# Altium project ECE_491_Quadcopter_Sigmux.PrjPcb
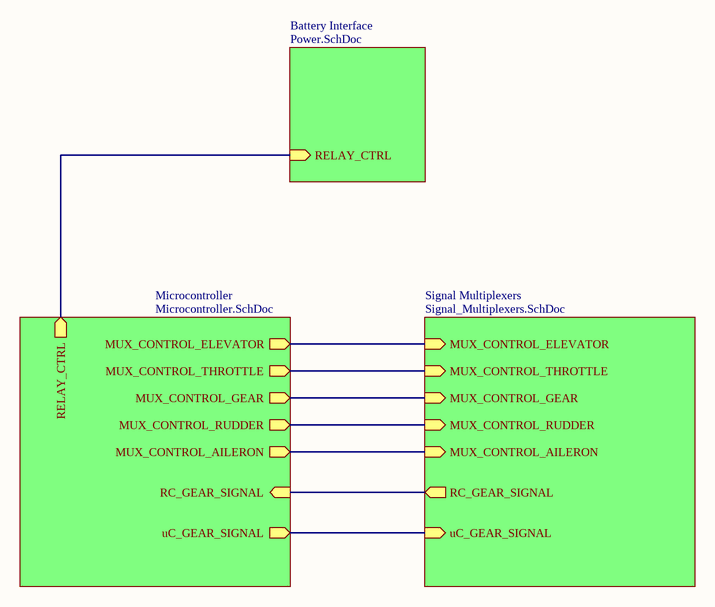
[diagram p0: Sigmux.SchDoc]
6 sheets, 56 parts. Net scope: hierarchical (ports join the sheet entries above them; power ports are global).
Board file: Sigmux.PcbDoc
Sheets:
  Sigmux.SchDoc
    Microcontroller = Microcontroller.SchDoc
    Battery Interface = Power.SchDoc
      Power Supplies = Power_Supplies.SchDoc
      Emergency Stop System = Relays.SchDoc
    Signal Multiplexers = Signal_Multiplexers.SchDoc

## Sheet Sigmux.SchDoc
size A4

### Sub-sheets
Battery Interface = Power.SchDoc: RELAY_CTRL (in)
Microcontroller = Microcontroller.SchDoc: MUX_CONTROL_ELEVATOR (out), MUX_CONTROL_THROTTLE (out), MUX_CONTROL_GEAR (out), RC_GEAR_SIGNAL (in), uC_GEAR_SIGNAL (out), RELAY_CTRL (out), MUX_CONTROL_RUDDER (out), MUX_CONTROL_AILERON (out)
Signal Multiplexers = Signal_Multiplexers.SchDoc: MUX_CONTROL_ELEVATOR (in), MUX_CONTROL_THROTTLE (in), MUX_CONTROL_GEAR (in), RC_GEAR_SIGNAL (out), uC_GEAR_SIGNAL (in), MUX_CONTROL_RUDDER (in), MUX_CONTROL_AILERON (in)

### Nets
MUX_CONTROL_AILERON: sheet Microcontroller/MUX_CONTROL_AILERON, sheet Signal Multiplexers/MUX_CONTROL_AILERON
MUX_CONTROL_ELEVATOR: sheet Microcontroller/MUX_CONTROL_ELEVATOR, sheet Signal Multiplexers/MUX_CONTROL_ELEVATOR
MUX_CONTROL_GEAR: sheet Microcontroller/MUX_CONTROL_GEAR, sheet Signal Multiplexers/MUX_CONTROL_GEAR
MUX_CONTROL_RUDDER: sheet Microcontroller/MUX_CONTROL_RUDDER, sheet Signal Multiplexers/MUX_CONTROL_RUDDER
MUX_CONTROL_THROTTLE: sheet Microcontroller/MUX_CONTROL_THROTTLE, sheet Signal Multiplexers/MUX_CONTROL_THROTTLE
RC_Gear_Signal: sheet Microcontroller/RC_GEAR_SIGNAL, sheet Signal Multiplexers/RC_GEAR_SIGNAL
RELAY_CTRL: sheet Microcontroller/RELAY_CTRL, sheet Battery Interface/RELAY_CTRL
uC_Gear_Signal: sheet Microcontroller/uC_GEAR_SIGNAL, sheet Signal Multiplexers/uC_GEAR_SIGNAL

### Notes on the sheet
- Title
- Size:
- Date:
- A4
- Number:
- Time:
- Revision:
- Sheet
- of
- File:

## Sheet Microcontroller.SchDoc
size B
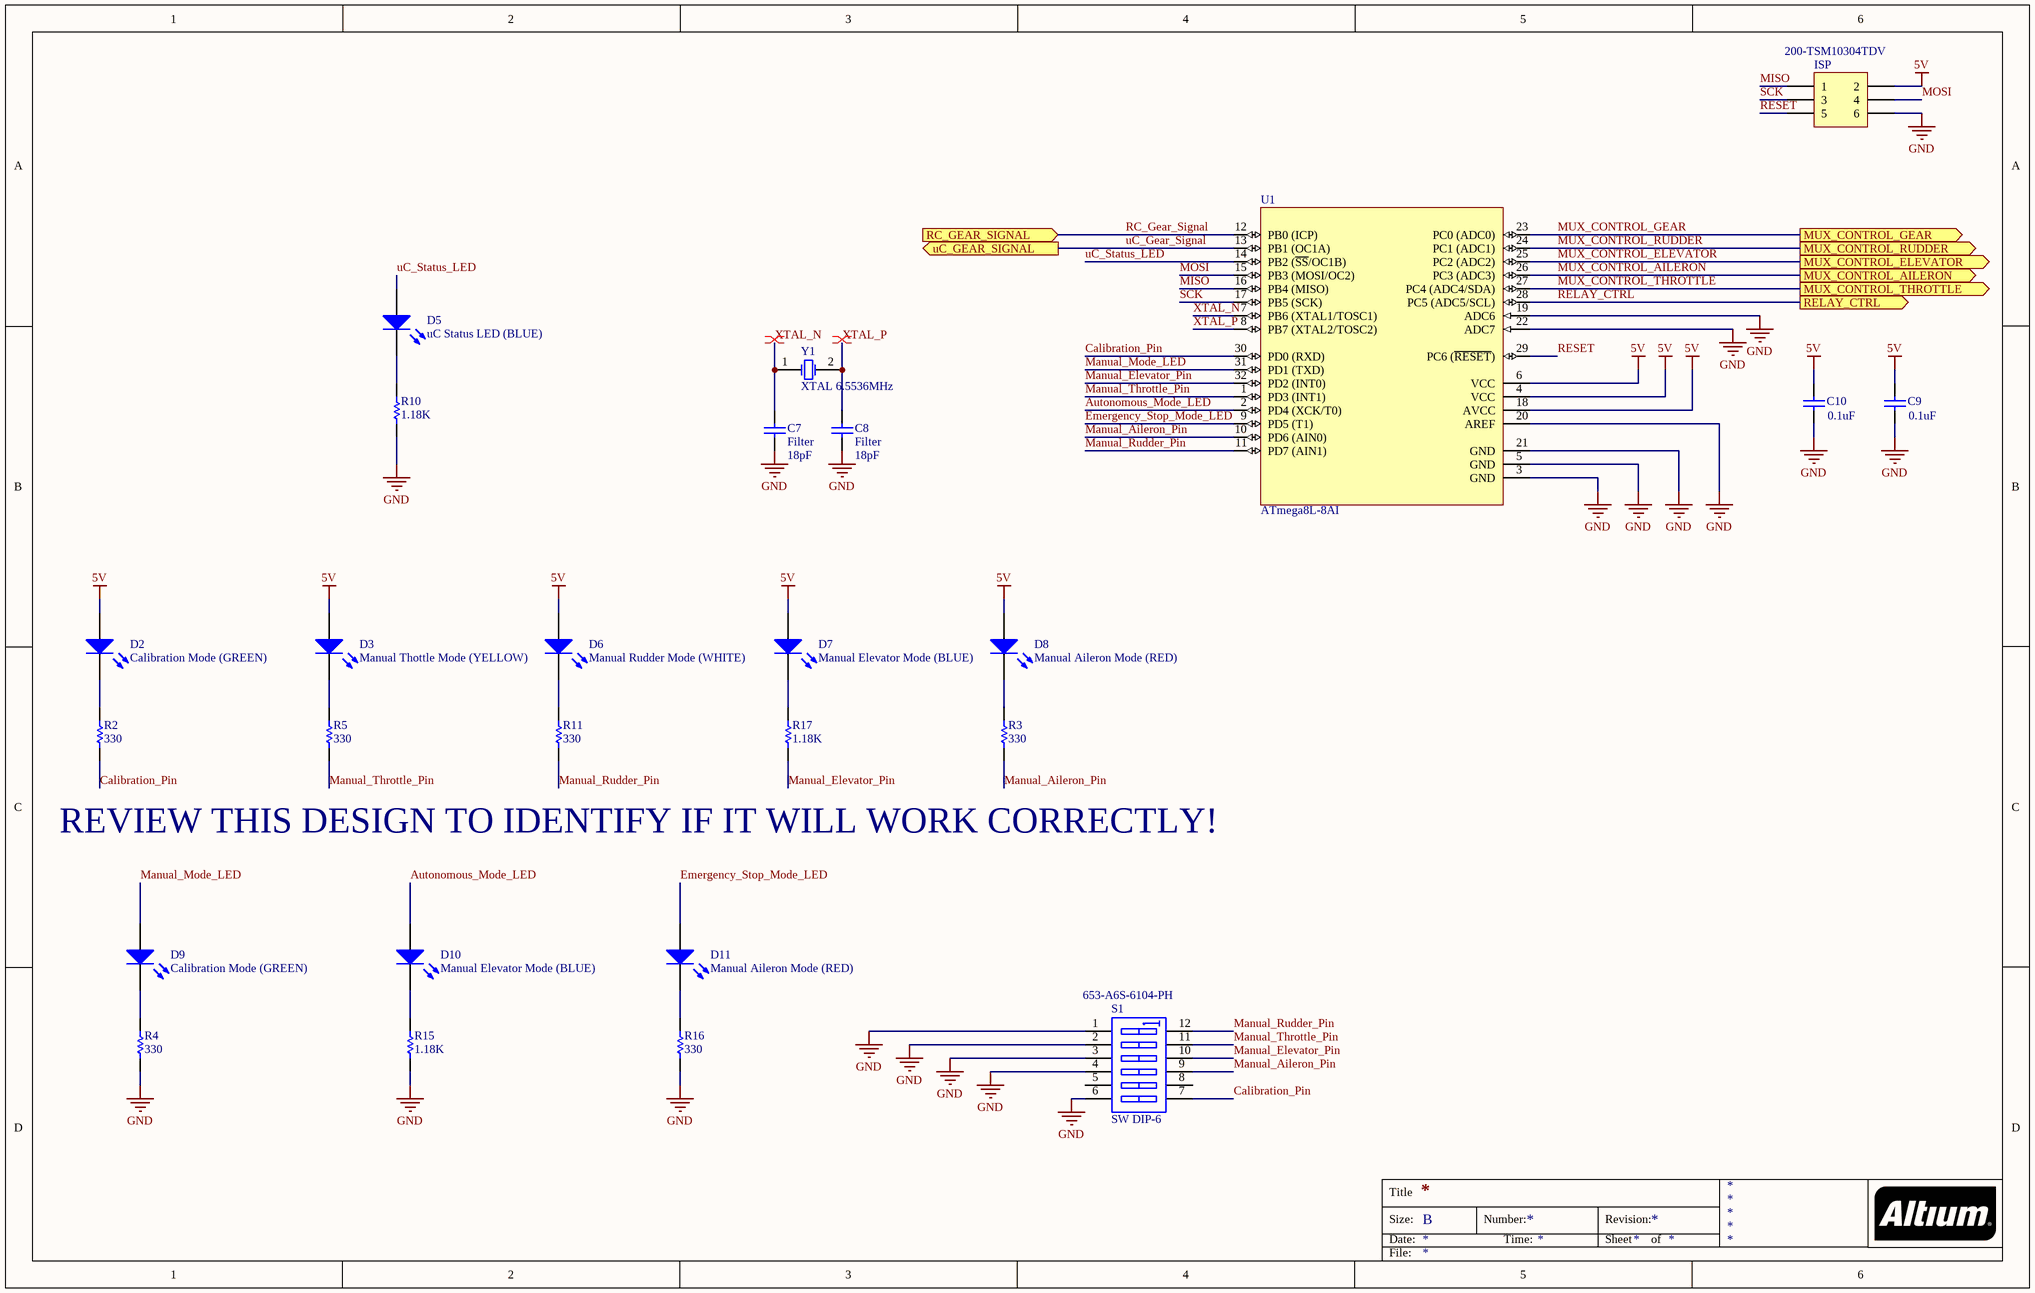
[diagram p1: Microcontroller.SchDoc]

### Parts
C7  Filter  value 18pF  [1608[0603]]
C8  Filter  value 18pF  [1608[0603]]
C9  value 0.1uF  [1608[0603]]  (hidden comment: Bypass Capacitor)
C10  value 0.1uF  [1608[0603]]  (hidden comment: Bypass Capacitor)
D2  Calibration Mode (GREEN)  [1608[0603]]
D3  Manual Thottle Mode (YELLOW)  [1608[0603]]
D5  uC Status LED (BLUE)  [1608[0603]]
D6  Manual Rudder Mode (WHITE)  [1608[0603]]
D7  Manual Elevator Mode (BLUE)  [1608[0603]]
D8  Manual Aileron Mode (RED)  [1608[0603]]
D9  Calibration Mode (GREEN)  [1608[0603]]
D10  Manual Elevator Mode (BLUE)  [1608[0603]]
D11  Manual Aileron Mode (RED)  [1608[0603]]
ISP  Supplier Part Number 1: 200-TSM10304TDV  [HDR2X3]  (hidden comment: Header 3X2)
R2  value 330  [1608[0603]]  (hidden comment: Current Limiting Resistor)
R3  value 330  [1608[0603]]  (hidden comment: Current Limiting Resistor)
R4  value 330  [1608[0603]]  (hidden comment: Current Limiting Resistor)
R5  value 330  [1608[0603]]  (hidden comment: Current Limiting Resistor)
R10  value 1.18K  [1608[0603]]  (hidden comment: Current Limiting Resistor)
R11  value 330  [1608[0603]]  (hidden comment: Current Limiting Resistor)
R15  value 1.18K  [1608[0603]]  (hidden comment: Current Limiting Resistor)
R16  value 330  [1608[0603]]  (hidden comment: Current Limiting Resistor)
R17  value 1.18K  [1608[0603]]  (hidden comment: Current Limiting Resistor)
S1  SW DIP-6  Supplier Part Number 1: 653-A6S-6104-PH  [A6S-6104-H]
U1  ATmega8L-8AI  [32A_N]
Y1  XTAL 6.5536MHz  [HC49/4H_SMX]

### Ports
MUX_CONTROL_AILERON (out), MUX_CONTROL_ELEVATOR (out), MUX_CONTROL_GEAR (out), MUX_CONTROL_RUDDER (out), MUX_CONTROL_THROTTLE (out), RC_GEAR_SIGNAL (in), RELAY_CTRL (out), uC_GEAR_SIGNAL (out)

### Nets
5V: C9.1 C10.1 D2.1(A) D3.1(A) D6.1(A) D7.1(A) D8.1(A) ISP.2 U1.4(VCC) U1.6(VCC) U1.18(AVCC)
GND: C7.1 C8.1 C9.2 C10.2 ISP.6 R4.1 R10.1 R15.1 R16.1 S1.1(A1) S1.2(A2) S1.3(A3) S1.4(A4) S1.6(A6) U1.3(GND) U1.5(GND) U1.19(ADC6) U1.20(AREF) U1.21(GND) U1.22(ADC7)
Autonomous_Mode_LED: D10.1(A) U1.2(PD4_(XCK/T0))
Calibration_Pin: R2.1 S1.7(B6) U1.30(PD0_(RXD))
Emergency_Stop_Mode_LED: D11.1(A) U1.9(PD5_(T1))
Manual_Aileron_Pin: R3.1 S1.9(B4) U1.10(PD6_(AIN0))
Manual_Elevator_Pin: R17.1 S1.10(B3) U1.32(PD2_(INT0))
Manual_Mode_LED: D9.1(A) U1.31(PD1_(TXD))
Manual_Rudder_Pin: R11.1 S1.12(B1) U1.11(PD7_(AIN1))
Manual_Throttle_Pin: R5.1 S1.11(B2) U1.1(PD3_(INT1))
MISO: ISP.1 U1.16(PB4_(MISO))
MOSI: ISP.4 U1.15(PB3_(MOSI/OC2))
MUX_CONTROL_AILERON: U1.26(PC3_(ADC3)) ; port MUX_CONTROL_AILERON
MUX_CONTROL_ELEVATOR: U1.25(PC2_(ADC2)) ; port MUX_CONTROL_ELEVATOR
MUX_CONTROL_GEAR: U1.23(PC0_(ADC0)) ; port MUX_CONTROL_GEAR
MUX_CONTROL_RUDDER: U1.24(PC1_(ADC1)) ; port MUX_CONTROL_RUDDER
MUX_CONTROL_THROTTLE: U1.27(PC4_(ADC4/SDA)) ; port MUX_CONTROL_THROTTLE
RC_Gear_Signal: U1.12(PB0_(ICP)) ; port RC_GEAR_SIGNAL
RELAY_CTRL: U1.28(PC5_(ADC5/SCL)) ; port RELAY_CTRL
RESET: ISP.5 U1.29(PC6_(~{RESET}))
SCK: ISP.3 U1.17(PB5_(SCK))
uC_Gear_Signal: U1.13(PB1_(OC1A)) ; port uC_GEAR_SIGNAL
uC_Status_LED: D5.1(A) U1.14(PB2_(~{SS}/OC1B))
XTAL_N: C7.2 U1.7(PB6_(XTAL1/TOSC1)) Y1.1(OSC1)
XTAL_P: C8.2 U1.8(PB7_(XTAL2/TOSC2)) Y1.2(OSC2)
NetD2_2: D2.2(K) R2.2
NetD3_2: D3.2(K) R5.2
NetD5_2: D5.2(K) R10.2
NetD6_2: D6.2(K) R11.2
NetD7_2: D7.2(K) R17.2
NetD8_2: D8.2(K) R3.2
NetD9_2: D9.2(K) R4.2
NetD10_2: D10.2(K) R15.2
NetD11_2: D11.2(K) R16.2

Not connected (* = marked no-connect by the designer): S1 5(A5) 8(B5)

### Layout directives
differential pair: XTAL_N, XTAL_P

### Notes on the sheet
- REVIEW THIS DESIGN TO IDENTIFY IF IT WILL WORK CORRECTLY!
- Title
- Size:
- Date:
- B
- Number:
- Time:
- Revision:
- Sheet
- of
- File:

### Library data of the parts
C7 C8 = Cap: Capacitor; Manufacturer: KEMET; Manufacturer Part Number: CBR06C180FAGAC; Tolerance: 1%; Voltage Rating: 250V; Published: 8-Jun-2000; LatestRevisionDate: 17-Jul-2002; LatestRevisionNote: Re-released for DXP Platform.; PackageReference: RAD-0.3; Publisher: Altium Limited; PackageDescription: Radial Cap, Thru-Hole; 2 Leads; 0.3 in Pin Spacing; Supplier 1: Mouser; Supplier Part Number 1: 80-CBR06C180FAGAC; Thickness: 0.034inch; Min Operating Temperature: -55°C; Case/Package: 0603; Max Operating Temperature: 125°C; Width: 0.031inch; Length: 0.063inch; ComponentLink1URL: https://datasheet.ciiva.com/6258/kem-c1030-cbr-smd-6258345.pdf; ComponentLink1Description: https://datasheet.ciiva.com/6258/kem-c1030-cbr-smd-6258345.pdf; ComponentLink2URL: https://datasheet.ciiva.com/6258/kem-c1030-cbr-smd-6258342.pdf; ComponentLink2Description: https://datasheet.ciiva.com/6258/kem-c1030-cbr-smd-6258342.pdf
C9 C10 = Cap: Multilayer Ceramic Capacitors MLCC - SMD/SMT 0603 .1uF 50volts X7R 10%; Manufacturer Part Number: VJ0603Y104KXAAC; Manufacturer: Vishay Semiconductors; Voltage Rating (DC): 50V; Supplier 1: Mouser; Supplier Part Number 1: 77-VJ0603Y104KXAAC; Min Operating Temperature: -55°C; Max Operating Temperature: 150°C; Tolerance: 10%; Lead Free: Lead Free; Depth: 0.8mm; Case/Package: 0603; Dielectric: X7R; Length: 1.6mm; ComponentLink1Description: Datasheet; ComponentLink1URL: https://www.mouser.com/datasheet/2/427/vjcommercialseries-222796.pdf
D2 D9 = LED0: Standard LEDs - SMD Ultra Green, 574nm 2.2V, 45mcd; Manufacturer: Lumex; Manufacturer Part Number: SML-LX0603SUGW-TR; Viewing Angle: 140°; Forward Current: 20mA; Lens Colour: White; Supplier 1: Mouser; Supplier Part Number 1: 696-SML-LX0603SUGW; Lead Free: Lead Free; Luminous Intensity: 45mcd; Length: 1.6mm; Width: 0.8mm; Height: 0.6mm; Test Current: 20mA; Dominant Wavelength: 574nm; Min Operating Temperature: -25°C; Max Operating Temperature: 85°C; Wavelength: 574nm; Case/Package: 0603; Forward Voltage: 2.2V; Colour: Green; ComponentLink1URL: https://datasheet.ciiva.com/7639/671274-7639178.pdf; ComponentLink1Description: https://datasheet.ciiva.com/7639/671274-7639178.pdf; ComponentLink2URL: https://datasheet.ciiva.com/2111/sml-lx0603sugw-tr-2111273.pdf; ComponentLink2Description: https://datasheet.ciiva.com/2111/sml-lx0603sugw-tr-2111273.pdf; ComponentLink3URL: https://datasheet.ciiva.com/7639/671274-7639177.pdf; ComponentLink3Description: https://datasheet.ciiva.com/7639/671274-7639177.pdf; ComponentLink4URL: https://datasheet.ciiva.com/46391/671274-46391015.pdf; ComponentLink4Description: https://datasheet.ciiva.com/46391/671274-46391015.pdf; ComponentLink5URL: https://datasheet.ciiva.com/2111/sml-lx0603sugw-tr-2111272.pdf; ComponentLink5Description: https://datasheet.ciiva.com/2111/sml-lx0603sugw-tr-2111272.pdf; ComponentLink6URL: https://datasheet.ciiva.com/2111/sml-lx0603sugw-tr-2111271.pdf; ComponentLink6Description: https://datasheet.ciiva.com/2111/sml-lx0603sugw-tr-2111271.pdf; ComponentLink7URL: https://datasheet.ciiva.com/4688/sml-lx0603sugw-tr-113249-4688850.pdf; ComponentLink7Description: https://datasheet.ciiva.com/4688/sml-lx0603sugw-tr-113249-4688850.pdf; ComponentLink8URL: https://datasheet.ciiva.com/16215/sml-lx0603sugw-tr-16215364.pdf; ComponentLink8Description: https://datasheet.ciiva.com/16215/sml-lx0603sugw-tr-16215364.pdf; ComponentLink9URL: https://datasheet.ciiva.com/30110/sml-lx0603sugw-tr-30110777.pdf; ComponentLink9Description: https://datasheet.ciiva.com/30110/sml-lx0603sugw-tr-30110777.pdf
D3 = LED0: Standard LEDs - SMD Yellow 589nm 22mcd 5mA; Manufacturer Part Number: LTST-C193KSKT-5A; Manufacturer: Vishay Lite-On; Forward Voltage: 2.3V; Dominant Wavelength: 594.5nm; Viewing Angle: 130°; Forward Current: 30mA; Lens Style: Diffused,Colorless,Rectangular; Lens Colour: Clear,Colorless; Lens Transparency: Clear; Reverse Voltage: 5V; Power Dissipation: 75mW; Luminous Intensity: 45mcd; Supplier 1: Mouser; Supplier Part Number 1: 859-LTSTC193KSKT5A; Test Current: 5mA; Colour: Yellow; Depth: 0.8mm; Max Operating Temperature: 85°C; Width: 0.8mm; Lead Free: Lead Free; Min Operating Temperature: -55°C; Case/Package: 0603; Length: 1.6mm; Height: 0.35mm; ComponentLink1URL: https://datasheet.ciiva.com/2110/s-110-ltst-c193kskt-5a-2110276.pdf; ComponentLink1Description: https://datasheet.ciiva.com/2110/s-110-ltst-c193kskt-5a-2110276.pdf; ComponentLink2URL: https://datasheet.ciiva.com/2110/s-110-ltst-c193kskt-5a-2110277.pdf; ComponentLink2Description: https://datasheet.ciiva.com/2110/s-110-ltst-c193kskt-5a-2110277.pdf; ComponentLink3URL: https://datasheet.ciiva.com/2110/s-110-ltst-c193kskt-5a-2110278.pdf; ComponentLink3Description: https://datasheet.ciiva.com/2110/s-110-ltst-c193kskt-5a-2110278.pdf; ComponentLink4URL: https://datasheet.ciiva.com/26890/getdatasheetpartid-683868-26890500.pdf; ComponentLink4Description: https://datasheet.ciiva.com/26890/getdatasheetpartid-683868-26890500.pdf; ComponentLink5URL: https://datasheet.ciiva.com/4688/lite-on-ltst-c193kskt-5a-187434-4688750.pdf; ComponentLink5Description: https://datasheet.ciiva.com/4688/lite-on-ltst-c193kskt-5a-187434-4688750.pdf; ComponentLink6URL: https://datasheet.ciiva.com/11775/0900766b80dc0553-11775611.pdf; ComponentLink6Description: https://datasheet.ciiva.com/11775/0900766b80dc0553-11775611.pdf
D5 D7 D10 = LED0: Standard LEDs - SMD 0603 Dome Lens LED Blue- 470nm; Manufacturer Part Number: APHD1608LVBC/D; Manufacturer: Kingbright; Luminous Intensity: 45 mcd; If - Forward Current: 2mA; Vf - Forward Voltage: 2.65V; Supplier 1: Mouser; Supplier Part Number 1: 604-APHD1608LVBCD; ComponentLink1Description: Datasheet; ComponentLink1URL: https://www.mouser.com/datasheet/2/216/APHD1608LVBC-D-1100823.pdf; Minimum Operating Temperature: -40C; Maximum Operating Temperature: +85C
D6 = LED0: Standard LEDs - SMD CHIPLED, WHITE; Manufacturer: Osram Opto; Manufacturer Part Number: Q65110-A7209; Forward Current: 15mA; Test Current: 5mA; Forward Voltage: 3.2V; Luminous Flux: 0.6lm; Reverse Voltage: 5V; Lens Style: Diffused,Colored,Rectangular; Luminous Intensity: 224mcd; Supplier 1: Mouser; Supplier Part Number 1: 720-LWQ38GQ1S13K6L1; Colour: White; Depth: 0.9mm; Min Operating Temperature: -40°C; Max Operating Temperature: 85°C; Length: 1.7mm; ComponentLink1URL: https://datasheet.ciiva.com/26937/getdatasheetpartid-780965-26937253.pdf; ComponentLink1Description: https://datasheet.ciiva.com/26937/getdatasheetpartid-780965-26937253.pdf
D8 D11 = LED0: Standard LEDs - SMD Super Red, 660nm 1.7V, 45mcd; Manufacturer Part Number: SML-LX0603SRW-TR; Manufacturer: Lumex; Forward Current: 20mA; Viewing Angle: 140°; Power Rating: 50mW; Lens Colour: White; Lens Style: Diffused,Colorless,Rectangular; Lens Transparency: Diffused; Supplier 1: Mouser; Supplier Part Number 1: 696-SML-LX0603SRW; Min Operating Temperature: -25°C; Length: 1.6mm; Lead Free: Lead Free; Case Code (Imperial): 0603; Colour: Red; Forward Voltage: 1.7V; Max Operating Temperature: 85°C; Wavelength: 660nm; Height: 0.6mm; Luminous Intensity: 45mcd; Case Code (Metric): 1608; Width: 0.8mm; Illumination Colour: Red; Test Current: 20mA; ComponentLink1URL: https://datasheet.ciiva.com/2110/sml-lx0603srw-tr-2110094.pdf; ComponentLink1Description: https://datasheet.ciiva.com/2110/sml-lx0603srw-tr-2110094.pdf; ComponentLink2URL: https://datasheet.ciiva.com/7639/269316-7639176.pdf; ComponentLink2Description: https://datasheet.ciiva.com/7639/269316-7639176.pdf; ComponentLink3URL: https://datasheet.ciiva.com/16200/sml-lx0603srw-tr-16200056.pdf; ComponentLink3Description: https://datasheet.ciiva.com/16200/sml-lx0603srw-tr-16200056.pdf; ComponentLink4URL: https://datasheet.ciiva.com/2110/sml-lx0603srw-tr-2110093.pdf; ComponentLink4Description: https://datasheet.ciiva.com/2110/sml-lx0603srw-tr-2110093.pdf; ComponentLink5URL: https://datasheet.ciiva.com/7639/269316-7639175.pdf; ComponentLink5Description: https://datasheet.ciiva.com/7639/269316-7639175.pdf; ComponentLink6URL: https://datasheet.ciiva.com/2110/sml-lx0603srw-tr-2110095.pdf; ComponentLink6Description: https://datasheet.ciiva.com/2110/sml-lx0603srw-tr-2110095.pdf; ComponentLink7URL: https://datasheet.ciiva.com/30115/sml-lx0603srw-tr-30115864.pdf; ComponentLink7Description: https://datasheet.ciiva.com/30115/sml-lx0603srw-tr-30115864.pdf; ComponentLink8URL: https://datasheet.ciiva.com/15967/sml-lx0603srw-tr-15967174.pdf; ComponentLink8Description: https://datasheet.ciiva.com/15967/sml-lx0603srw-tr-15967174.pdf; ComponentLink9URL: https://datasheet.ciiva.com/4689/sml-lx0603srw-tr-113242-4689205.pdf; ComponentLink9Description: https://datasheet.ciiva.com/4689/sml-lx0603srw-tr-113242-4689205.pdf
ISP = Header 3X2: Header, 3-Pin, Dual row; Manufacturer: Samtec; Manufacturer Part Number: TSM-103-04-T-DV; Max Current Rating: 7A; Pitch: 2.54mm; Number of Contacts: 6; Gender: Male; Max Voltage Rating (AC): 475V; LatestRevisionDate: 17-Jul-2002; LatestRevisionNote: Re-released for DXP Platform.; Publisher: Altium Limited; Supplier 1: Mouser; Depth: 5.08mm; Contact Plating: Tin; Lead Free: Lead Free; Housing Material: Polymer; Length: 7.62mm; Min Operating Temperature: -55°C; Max Operating Temperature: 105°C; Housing Colour: Black; Orientation: Straight; Contact Material: Bronze; Number of Rows: 2; ComponentLink1URL: http://datasheet.octopart.com/TSM-103-04-T-DV-Samtec-datasheet-31667586.pdf; ComponentLink1Description: http://datasheet.octopart.com/TSM-103-04-T-DV-Samtec-datasheet-31667586.pdf; ComponentLink2URL: http://datasheet.octopart.com/TSM-103-04-T-DV-Samtec-datasheet-12008796.pdf; ComponentLink2Description: http://datasheet.octopart.com/TSM-103-04-T-DV-Samtec-datasheet-12008796.pdf; ComponentLink3URL: http://datasheet.octopart.com/TSM-103-04-T-DV-Samtec-datasheet-10407325.pdf; ComponentLink3Description: http://datasheet.octopart.com/TSM-103-04-T-DV-Samtec-datasheet-10407325.pdf; ComponentLink4URL: http://datasheet.octopart.com/TSM-103-04-T-DV-Samtec-datasheet-21214708.pdf; ComponentLink4Description: http://datasheet.octopart.com/TSM-103-04-T-DV-Samtec-datasheet-21214708.pdf; ComponentLink5URL: http://datasheet.octopart.com/TSM-103-04-T-DV-Samtec-datasheet-11542650.pdf; ComponentLink5Description: http://datasheet.octopart.com/TSM-103-04-T-DV-Samtec-datasheet-11542650.pdf; ComponentLink6URL: http://datasheet.octopart.com/TSM-103-04-T-DV-Samtec-datasheet-41643181.pdf; ComponentLink6Description: http://datasheet.octopart.com/TSM-103-04-T-DV-Samtec-datasheet-41643181.pdf; ComponentLink7URL: http://datasheet.octopart.com/TSM-103-04-T-DV-Samtec-datasheet-68527555.pdf; ComponentLink7Description: http://datasheet.octopart.com/TSM-103-04-T-DV-Samtec-datasheet-68527555.pdf; ComponentLink8URL: http://sigma.octopart.com/97319595/technical_drawing/Samtec-TSM-103-04-T-DV.pdf; ComponentLink8Description: http://sigma.octopart.com/97319595/technical_drawing/Samtec-TSM-103-04-T-DV.pdf; ComponentLink9URL: http://datasheet.octopart.com/TSM-103-04-T-DV-Samtec-datasheet-97319594.pdf; ComponentLink9Description: http://datasheet.octopart.com/TSM-103-04-T-DV-Samtec-datasheet-97319594.pdf
R2-R5 R11 R16 = Res1: Thick Film Resistors - SMD 330 ohm 0.5% 0.33W AEC-Q200; Manufacturer: KOA Speer; Manufacturer Part Number: SG73G1JTTD3300D; Power Rating: 330mW; Supplier 1: Mouser; Supplier Part Number 1: 660-SG73G1JTTD3300D; ComponentLink1Description: Datasheet; ComponentLink1URL: https://www.mouser.com/datasheet/2/219/SG73G-1316861.pdf; Tolerance: 0.5%
R10 R15 R17 = Res1: Thin Film Resistors - SMD 1/16W 1.18Kohm 0.5% 25ppm; Manufacturer: Susumu; Manufacturer Part Number: RR0816P-1181-D-08H; Power Rating: 62.5mW; Voltage Rating: 75V; Max Power Dissipation: 63mW; Temperature Coefficient: 25ppm/°C; ComponentLink1Description: Datasheet; ComponentLink1URL: https://www.mouser.com/datasheet/2/219/SG73G-1316861.pdf; Supplier 1: Mouser; Supplier Part Number 1: 754-RR0816P-1181D08H; Case/Package: 0603; Weight: 7.1E-05oz; Min Operating Temperature: -55°C; Max Operating Temperature: 125°C; Composition: Thin Film; Tolerance: 0.5%; Length: 0.063inch; Height: 0.02inch; Width: 0.031inch; Lead Free: Lead Free; ComponentLink2URL: https://datasheet.ciiva.com/2518/rr-data-sheet-2518672.pdf; ComponentLink2Description: https://datasheet.ciiva.com/2518/rr-data-sheet-2518672.pdf; ComponentLink3URL: https://datasheet.ciiva.com/2518/rr-data-sheet-2518670.pdf; ComponentLink3Description: https://datasheet.ciiva.com/2518/rr-data-sheet-2518670.pdf; ComponentLink4URL: https://datasheet.ciiva.com/2518/rr-data-sheet-2518671.pdf; ComponentLink4Description: https://datasheet.ciiva.com/2518/rr-data-sheet-2518671.pdf
S1 = SW DIP-6: DIP Switches / SIP Switches 6 Pole Raised Act. Dip SW; Manufacturer Part Number: A6S-6104-PH; Manufacturer: Omron; Throw Configuration: SPST; Electrical Life: 1000Cycles; Voltage Rating (DC): 24V; Current Rating: 25mA; Pitch: 0.1inch; PackageReference: DIP-12/SW; PackageDescription: DIP Switch; 12 Leads; Supplier 1: Mouser; Length: 0.637inch; Contact Plating: Gold; Max Operating Temperature: 70°C; Min Operating Temperature: -20°C; Max Voltage Rating (DC): 24V; Termination: Gull Wing; ComponentLink1URL: https://datasheet.ciiva.com/48485/en-a6s-48485127.pdf; ComponentLink1Description: https://datasheet.ciiva.com/48485/en-a6s-48485127.pdf; ComponentLink2URL: https://datasheet.ciiva.com/5258/a6s-h-1110-11975-5258393.pdf; ComponentLink2Description: https://datasheet.ciiva.com/5258/a6s-h-1110-11975-5258393.pdf
U1 = ATmega8L-8AI: 8-Bit AVR Microcontroller with 8K Bytes of In-System Programmable Flash Memory; Published: 17-Sep-2003; LatestRevisionDate: 16-Oct-2006; LatestRevisionNote: IPC-7351 Footprint Added.; DatasheetVersion: 2486H-AVR-09/02; PackageVersion: revB, Oct-2001; PackageReference: 32A; Publisher: Altium Limited; PackageDescription: 32-Lead, 7x7x1.0 mm Body, 0.8mm Lead Pitch, Thin Profile Plastic Quad Flat Package (TQFP); Supplier 1: Digi-Key; Supplier Part Number 1: ATMEGA8L-8AI-ND; Supplier 2: Farnell; Supplier Part Number 2: 3917952; Supplier 3: Mouser; Supplier Part Number 3: 556-ATMEGA8L-8AU; Code_JEDEC: MS-026-ABA; ComponentLink1Description: Datasheet; ComponentLink1URL: http://www.atmel.com/dyn/resources/prod_documents/doc2486.pdf
Y1 = XTAL: Crystals 6.5536MHz SERIES; Manufacturer: ECS International; Manufacturer Part Number: ECS-65.5-S-5PX-TR; Frequency Stability: 50ppm; Tolerance: 30ppm; Shunt Capacitance: 7pF; Maximum ESR: 70; Drive Level: 500uW; Supplier 1: Mouser; Supplier Part Number 1: 520-CSM655-S-X; Max Operating Temperature: 70°C; Min Operating Temperature: -10°C; Height: 4.3mm; Length: 13.2mm; Width: 4.8mm; Frequency: 6.5536MHz; ComponentLink1Description: Datasheet; ComponentLink1URL: https://www.mouser.com/datasheet/2/122/csm-7x-1299.pdf; Load Capacitance: Series

## Sheet Power.SchDoc
size A
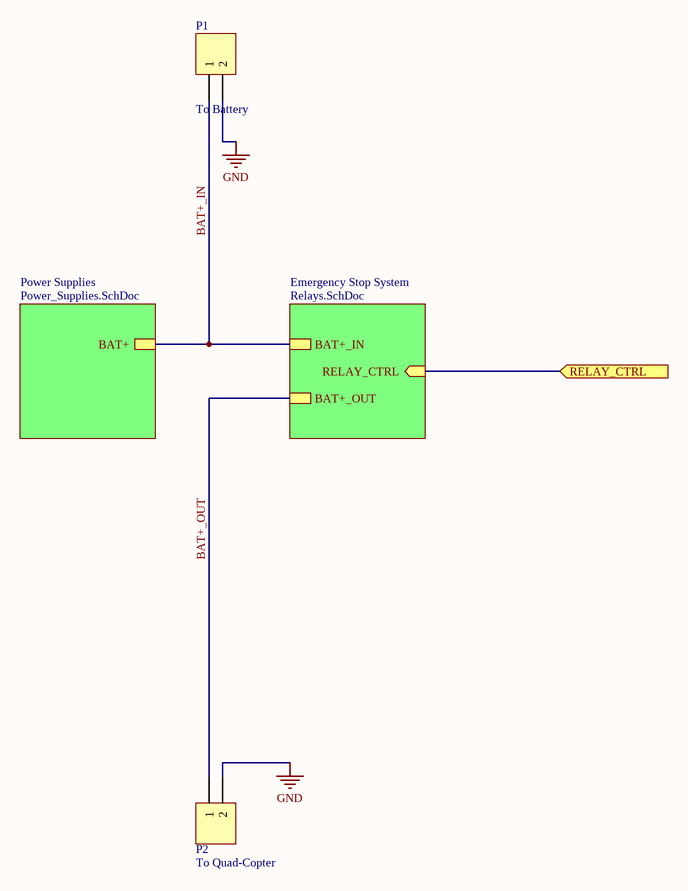
[diagram p2: Power.SchDoc]

### Parts
P1  To Battery  [XT60]
P2  To Quad-Copter  [XT60]

### Sub-sheets
Emergency Stop System = Relays.SchDoc: BAT+_IN, BAT+_OUT, RELAY_CTRL (in)
Power Supplies = Power_Supplies.SchDoc: BAT+

### Ports
RELAY_CTRL (in)

### Nets
GND: P1.2 P2.2
BAT+_IN: P1.1 ; sheet Power Supplies/BAT+, sheet Emergency Stop System/BAT+_IN  [project net BAT+]
BAT+_OUT: P2.1 ; sheet Emergency Stop System/BAT+_OUT
RELAY_CTRL: port RELAY_CTRL, sheet Emergency Stop System/RELAY_CTRL

### Library data of the parts
P1 P2 = Header 2: XT60; Manufacturer Part Number: PRT-10474; Manufacturer: SparkFun; Supplier 1: Mouser; Supplier Part Number 1: 474-PRT-10474

## Sheet Power_Supplies.SchDoc
size B
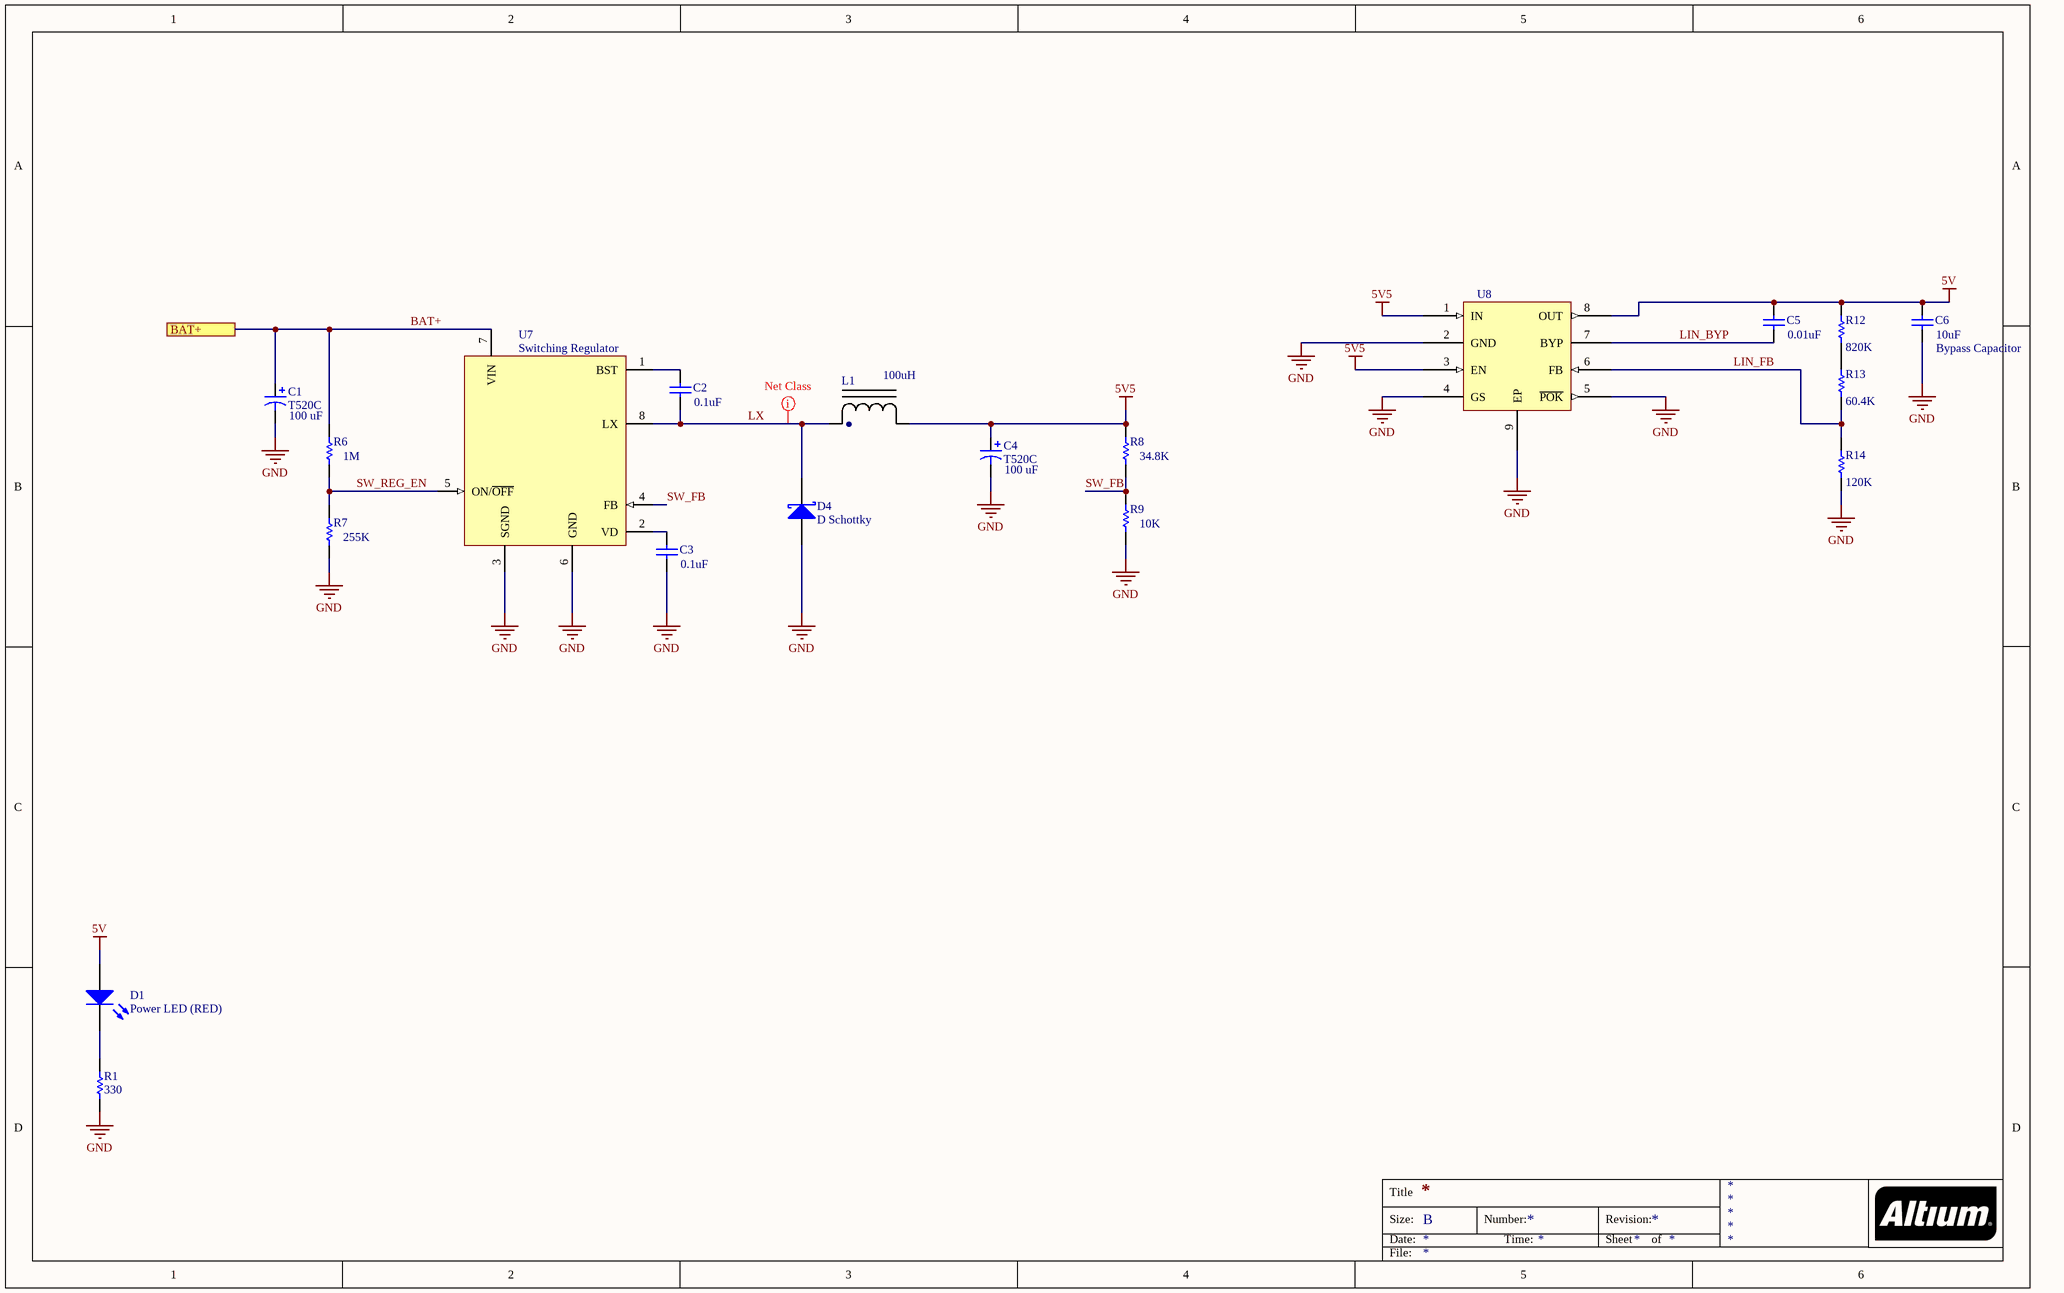
[diagram p3: Power_Supplies.SchDoc]

### Parts
C1  T520C  value 100 uF  [C]
C2  value 0.1uF  [1608[0603]]  (hidden comment: Cap)
C3  value 0.1uF  [1608[0603]]  (hidden comment: Cap)
C4  T520C  value 100 uF  [C]
C5  value 0.01uF  [1608[0603]]
C6  Bypass Capacitor  value 10uF  [C1206]
D1  Power LED (RED)  [1608[0603]]
D4  D Schottky  [SOD123]
L1  value 100uH  [UP1B]  (hidden comment: UP1B-101-R)
R1  value 330  [1608[0603]]  (hidden comment: Current Limiting Resistor)
R6  value 1M  [1608[0603]]  (hidden comment: Res1)
R7  value 255K  [1608[0603]]  (hidden comment: Res1)
R8  value 34.8K  [1608[0603]]
R9  value 10K  [1608[0603]]
R12  value 820K  [1608[0603]]  (hidden comment: Res1)
R13  value 60.4K  [1608[0603]]  (hidden comment: Res1)
R14  value 120K  [1608[0603]]  (hidden comment: Res1)
U7  Switching Regulator  [SOIC8_N]
U8  MAX8902BATA+T  [8 TDFN-EP]  (value not drawn)

### Ports
BAT+

### Nets
5V: C5.2 C6.2 D1.1(A) R12.2 U8.8(OUT)
5V5: C4.1 L1.2 R8.2 U8.1(IN) U8.3(EN)
GND: C1.2 C3.2 C4.2 C6.1 D4.1(K) R1.1 R7.1 R9.1 R14.1 U7.3(SGND) U7.6(GND) U8.2(GND) U8.4(GS) U8.5(~{POK}) U8.9(EP)
BAT+: C1.1 R6.2 U7.7(VIN) ; port BAT+
LIN_BYP: C5.1 U8.7(BYP)
LIN_FB: R13.1 R14.2 U8.6(FB)
LX: C2.2 D4.2(A) L1.1 U7.8(LX)
SW_FB: R8.1 R9.2 U7.4(FB)
SW_REG_EN: R6.1 R7.2 U7.5(ON/~{OFF})
NetC2_1: C2.1 U7.1(BST)
NetC3_1: C3.1 U7.2(VD)
NetD1_2: D1.2(K) R1.2
NetR12_1: R12.1 R13.2

### Layout directives
net class POWER: LX

### Notes on the sheet
- Title
- Size:
- Date:
- B
- Number:
- Time:
- Revision:
- Sheet
- of
- File:
- (in symbol UP1B-100-R) .

### Library data of the parts
C1 C4 = T520D: Tantalum Capacitors - Polymer SMD 6.3volts 100uF 20% ESR=5mOhms; Mfr Case Code: C Case; Manufacturer: KEMET; Manufacturer Part Number: T520C107M006ANE005; Voltage Rating: 6.3 VDC; ESR: 5 mOhms; Supplier 1: Mouser; Supplier Part Number 1: 80-T520C107M6ANE5; Package / Case: 2312 (6032 metric); Height: 2.5 mm; Length: 6 mm; Width: 3.2 mm; Case Code - mm: 6032; Minimum Operating Temperature: - 55 C; Series: T520; Tolerance: 20 %; Case Code - in: 2312; ComponentLink1URL: http://www.mouser.com/ds/2/212/KEM_T2076_T52X-530-1104134.pdf; ComponentLink1Description: http://www.mouser.com/ds/2/212/KEM_T2076_T52X-530-1104134.pdf; Pricing: 1=2.05, 10=1.63, 100=1.18, 500=0.800, 1000=0.699, 2500=0.650, 10000=0.625 (USD)
C2 C3 = Cap: as C9 on sheet Microcontroller; Supplier 1: Mouser; Supplier Part Number 1: 77-VJ0603Y104KXAAC; Min Operating Temperature: -55°C; Max Operating Temperature: 150°C; Tolerance: 10%; Lead Free: Lead Free; Depth: 0.8mm; Case/Package: 0603; Dielectric: X7R; Length: 1.6mm; ComponentLink1Description: Datasheet; ComponentLink1URL: https://www.mouser.com/datasheet/2/427/vjcommercialseries-222796.pdf
C5 = Cap: Multilayer Ceramic Capacitors MLCC - SMD/SMT 50volts 10000pF X7R 5%; Manufacturer Part Number: C0603C103J5RALTU; Manufacturer: KEMET; Dissipation Factor: 2.5%; Voltage Rating: 50V; ComponentLink1Description: Datasheet; ComponentLink1URL: http://www.kemet.com/docfinder?Partnumber=C0603C103J5RACTU; Supplier 1: Mouser; Supplier Part Number 1: 80-C0603C103J5RAL; Dielectric: X7R; Thickness: 0.034inch; Height: 0.8mm; Lead Pitch: 0.7mm; Width: 0.8mm; Depth: 0.8mm; Length: 1.6mm; Case Code (Imperial): 0603; Min Operating Temperature: -55°C; Dielectric Material: Ceramic; Max Operating Temperature: 125°C; Tolerance: 5%
C6 = Cap: Multilayer Ceramic Capacitors MLCC - SMD/SMT SOFT 1206 25V 10uF X7R 20% T: 1.6mm; Manufacturer Part Number: C3216X7R1E106M160AE; Manufacturer: TDK; Supplier 1: Mouser; Supplier Part Number 1: 810-C3216X7R1E106MST; Weight: 0.000571oz; Depth: 1.6mm; Composition: Ceramic; Min Operating Temperature: -55°C; Thickness: 0.071inch; Max Operating Temperature: 125°C; Voltage Rating: 25V; Dielectric: X7R; Width: 0.063inch; Lead Free: Lead Free; Tolerance: 20%; Height: 1.8mm; Case Code (Imperial): 1206; Length: 3.2mm; ComponentLink1URL: https://datasheet.ciiva.com/6285/mlcc-commercial-soft-en-6285640.pdf; ComponentLink1Description: https://datasheet.ciiva.com/6285/mlcc-commercial-soft-en-6285640.pdf; ComponentLink2URL: https://datasheet.ciiva.com/24218/c3216x7r1e106m160ae-265316-24218060.pdf; ComponentLink2Description: https://datasheet.ciiva.com/24218/c3216x7r1e106m160ae-265316-24218060.pdf; ComponentLink3URL: https://datasheet.ciiva.com/6285/mlcc-commercial-soft-en-6285643.pdf; ComponentLink3Description: https://datasheet.ciiva.com/6285/mlcc-commercial-soft-en-6285643.pdf
D1 = LED0: as D8 on sheet Microcontroller; Supplier 1: Mouser; Supplier Part Number 1: 696-SML-LX0603SRW; Min Operating Temperature: -25°C; Length: 1.6mm; Lead Free: Lead Free; Case Code (Imperial): 0603; Colour: Red; Forward Voltage: 1.7V; Max Operating Temperature: 85°C; Wavelength: 660nm; Height: 0.6mm; Luminous Intensity: 45mcd; Case Code (Metric): 1608; Width: 0.8mm; Illumination Colour: Red; Test Current: 20mA; ComponentLink1URL: https://datasheet.ciiva.com/2110/sml-lx0603srw-tr-2110094.pdf; ComponentLink1Description: https://datasheet.ciiva.com/2110/sml-lx0603srw-tr-2110094.pdf; ComponentLink2URL: https://datasheet.ciiva.com/7639/269316-7639176.pdf; ComponentLink2Description: https://datasheet.ciiva.com/7639/269316-7639176.pdf; ComponentLink3URL: https://datasheet.ciiva.com/16200/sml-lx0603srw-tr-16200056.pdf; ComponentLink3Description: https://datasheet.ciiva.com/16200/sml-lx0603srw-tr-16200056.pdf; ComponentLink4URL: https://datasheet.ciiva.com/2110/sml-lx0603srw-tr-2110093.pdf; ComponentLink4Description: https://datasheet.ciiva.com/2110/sml-lx0603srw-tr-2110093.pdf; ComponentLink5URL: https://datasheet.ciiva.com/7639/269316-7639175.pdf; ComponentLink5Description: https://datasheet.ciiva.com/7639/269316-7639175.pdf; ComponentLink6URL: https://datasheet.ciiva.com/2110/sml-lx0603srw-tr-2110095.pdf; ComponentLink6Description: https://datasheet.ciiva.com/2110/sml-lx0603srw-tr-2110095.pdf; ComponentLink7URL: https://datasheet.ciiva.com/30115/sml-lx0603srw-tr-30115864.pdf; ComponentLink7Description: https://datasheet.ciiva.com/30115/sml-lx0603srw-tr-30115864.pdf; ComponentLink8URL: https://datasheet.ciiva.com/15967/sml-lx0603srw-tr-15967174.pdf; ComponentLink8Description: https://datasheet.ciiva.com/15967/sml-lx0603srw-tr-15967174.pdf; ComponentLink9URL: https://datasheet.ciiva.com/4689/sml-lx0603srw-tr-113242-4689205.pdf; ComponentLink9Description: https://datasheet.ciiva.com/4689/sml-lx0603srw-tr-113242-4689205.pdf
D4 = D Schottky: Schottky Diodes & Rectifiers Schottky Power Rect .5a; Manufacturer Part Number: MBR0520L; Manufacturer: ON Semiconductor / Fairchild; If - Forward Current: 0.5 A; Ifsm - Forward Surge Current: 5.5 A; Ir - Reverse Current: 250 uA; Vf - Forward Voltage: 0.385 V; Vrrm - Repetitive Reverse Voltage: 20 V; LatestRevisionDate: 17-Jul-2002; LatestRevisionNote: Re-released for DXP Platform.; Code_JEDEC: DO-214-AA; Supplier 1: Mouser; Supplier Part Number 1: 512-MBR0520L; Height: 1.17 mm (Max); Technology: Si; Operating Temperature Range: - 65 C to + 125 C; Length: 2.85 mm (Max); Package / Case: SOD-123; Type: Schottky Diode; Width: 1.8 mm (Max); Datasheet: http://www.mouser.com/ds/2/308/MBR0520L-1124987.pdf; Supplier 2: Digi-Key; Supplier Part Number 2: MBR0520LCT-ND
L1 = UP1B-100-R: Fixed Inductors 100uH 0.53A 1.11ohms; Manufacturer: Eaton; DC Resistance (DCR): 1.11R; Tolerance: 20%; Current Rating: 470mA; Shielding: Unshielded; Saturation Current: 530mA; Test Frequency: 100kHz; Core Material: Ferrite; Supplier 1: Mouser; Supplier Part Number 1: 704-UP1B-101-R; Max Operating Temperature: 85°C; Manufacturer Part Number: UP1B-101-R; DC Current: 470mA; Width: 0.24inch; Depth: 6.1mm; Min Operating Temperature: -40°C; Height - Seated (Max): 0.197inch; ComponentLink1Description: Datasheet; ComponentLink1URL: https://www.mouser.com/datasheet/2/87/BUS_Elx_PM_4308_UNI_PAC_Power_Inductors-268242.pdf
R1 = Res1: as R2 on sheet Microcontroller; Supplier 1: Mouser; Supplier Part Number 1: 660-SG73G1JTTD3300D; ComponentLink1Description: Datasheet; ComponentLink1URL: https://www.mouser.com/datasheet/2/219/SG73G-1316861.pdf; Tolerance: 0.5%
R6 = Res1: Thin Film Resistors - SMD 1M OHM .1% 25PPM; Manufacturer Part Number: RT0603BRD071ML; Manufacturer: Yageo; Tolerance: 0.1%; Max Power Dissipation: 100mW; Temperature Coefficient: 25ppm/°C; Supplier 1: Mouser; Supplier Part Number 1: 603-RT0603BRD071ML; Length: 0.063inch; Width: 0.031inch; Min Operating Temperature: -55°C; Max Operating Temperature: 155°C; Height: 0.022inch; Case/Package: 0603; Composition: Thin Film; ComponentLink1Description: Datasheet; ComponentLink1URL: https://www.mouser.com/datasheet/2/447/PYu-RT_1-to-0.01_RoHS_L_9-1222720.pdf
R7 = Res1: Thin Film Resistors - SMD 255Kohms .1% 25ppm; Manufacturer: Vishay Dale; Manufacturer Part Number: TNPW0603255KBEEN; Voltage Rating: 75V; Power Rating: 100mW; Tolerance: 0.1%; Temperature Coefficient: 25ppm/°C; Supplier 1: Mouser; Supplier Part Number 1: 71-TNPW0603255KBEEN; Width: 0.8mm; Weight: 7.1E-05oz; Length: 0.063inch; Max Operating Temperature: 125°C; Case Code (Imperial): 0603; Radiation Hardening: No; Composition: Thin Film; Contact Plating: Tin; Min Operating Temperature: -55°C; Height: 0.022inch; ComponentLink1URL: https://datasheet.ciiva.com/2614/tnpw-e3-2614598.pdf; ComponentLink1Description: Datasheet
R8 = Res1: Thin Film Resistors - SMD 150mW 34.8kohm 0.1% 25PPM 0603; Manufacturer: Vishay; Manufacturer Part Number: PAT0603E3482BST1; Voltage Rating: 75 V; Temperature Coefficient: 25 PPM / C; Supplier 1: Mouser; Supplier Part Number 1: 71-PAT0603E3482BST1; Power Rating: 150 mW; Tolerance: 0.1 %; Operating Temperature Range: - 55 C to + 125 C; Package / Case: 0603 (1608 metric); Width: 0.762 mm; ComponentLink1Description: Datasheet; ComponentLink1URL: http://www.mouser.com/ds/2/427/pat-247403.pdf
R9 = Res1: Thin Film Resistors - SMD 150mW 10kohm 0.1% 25PPM 0603; Manufacturer: Vishay; Manufacturer Part Number: PAT0603E1002BST1; Temperature Coefficient: 25 PPM / C; Voltage Rating: 75 V; Supplier 1: Mouser; Supplier Part Number 1: 71-PAT0603E1002BST1; Supplier 2: Digi-Key; Supplier Part Number 2: PAT10KACT-ND; Length: 1.524 mm; Power Rating: 150 mW; Height: 0.254 mm; Tolerance: 0.1 %; Package / Case: 0603 (1608 metric); Operating Temperature Range: - 55 C to + 125 C; Width: 0.762 mm; Datasheet: http://www.mouser.com/ds/2/427/pat-247403.pdf; ComponentLink1Description: Datasheet; ComponentLink1URL: http://www.mouser.com/ds/2/427/pat-247403.pdf
R12 = Res1: Thin Film Resistors - SMD CPF0603 820K 0.1% 25PPM 5K RL; Manufacturer: TE Connectivity; Manufacturer Part Number: CPF0603B820KE; Power Rating: 63mW; Temperature Coefficient: 25ppm/°C; Supplier 1: Mouser; Supplier Part Number 1: 279-CPF0603B820KE; ComponentLink1URL: https://datasheet.ciiva.com/11819/0900766b80d2f5da-11819682.pdf; ComponentLink1Description: https://datasheet.ciiva.com/11819/0900766b80d2f5da-11819682.pdf; Case/Package: 0603; Height: 0.45mm; Min Operating Temperature: -55°C; Length: 1.6mm; Depth: 0.8mm; Tolerance: 0.1%; Max Operating Temperature: 125°C
R13 = Res1: Thin Film Resistors - SMD .063W 60.4K ohm 0.1% 25ppm; Manufacturer: TT Welwyn; Manufacturer Part Number: PCF0603R-60K4BT1; Temperature Coefficient: 25ppm/°C; Power Rating: 63mW; Voltage Rating: 50V; Supplier 1: Mouser; Supplier Part Number 1: 756-PCF0603R-60K4BT1; Width: 0.8mm; Composition: Metal Film,Thin Film; Tolerance: 0.1%; Max Operating Temperature: 125°C; Min Operating Temperature: -55°C; ComponentLink1URL: https://datasheet.ciiva.com/48780/1315872-48780789.pdf; ComponentLink1Description: https://datasheet.ciiva.com/48780/1315872-48780789.pdf; ComponentLink2URL: https://datasheet.ciiva.com/48780/1315872-48780790.pdf; ComponentLink2Description: https://datasheet.ciiva.com/48780/1315872-48780790.pdf; ComponentLink3URL: https://datasheet.ciiva.com/12834/pcf-437472-12834504.pdf; ComponentLink3Description: https://datasheet.ciiva.com/12834/pcf-437472-12834504.pdf
R14 = Res1: Thin Film Resistors - SMD CPF 0603 120K 0.1% 25PPM 1K RL; Manufacturer Part Number: CPF0603B120KE1; Manufacturer: TE Connectivity; Power Rating: 63mW; Temperature Coefficient: 25ppm/°C; Voltage Rating: 50V; Supplier 1: Mouser; Supplier Part Number 1: 279-CPF0603B120KE1; Case/Package: 0603; Min Operating Temperature: -55°C; Height: 0.45mm; Max Operating Temperature: 155°C; Width: 0.8mm; Weight: 7.1E-05oz; Tolerance: 0.1%; Length: 1.55mm; Composition: Thin Film; ComponentLink1URL: https://datasheet.ciiva.com/22670/1723857-22670584.pdf; ComponentLink1Description: https://datasheet.ciiva.com/22670/1723857-22670584.pdf; ComponentLink2URL: https://datasheet.ciiva.com/12793/eng-ds-1773200-i-12793932.pdf; ComponentLink2Description: https://datasheet.ciiva.com/12793/eng-ds-1773200-i-12793932.pdf
U7 = MAX5035: Switching Voltage Regulators 1A 76V MAXPower Step-Down; Manufacturer: Maxim; Manufacturer Part Number: MAX5035DASA+T; Max Output Voltage: 13.2V; Switching Frequency: 125kHz; Output Type: Adjustable; Min Output Voltage: 1.25V; Output Configuration: Positive; Min Input Voltage: 7.5V; ComponentLink1Description: Datasheet; ComponentLink1URL: https://datasheets.maximintegrated.com/en/ds/MAX5035.pdf; Supplier 1: Mouser; Max Output Current: 1A; Max Operating Temperature: 125°C; Max Input Voltage: 76V; Min Operating Temperature: -40°C; Output Voltage: 13.2V; Supplier Part Number 1: 700-MAX5035DASA-T-NR
U8 = MAX8902BATA+T: LDO Voltage Regulators 500mA LDO Regulator; Manufacturer: Maxim Integrated; Manufacturer Part Number: MAX8902AATA+T; Input Voltage Range: 1.7V to 5.5V; Output Voltage Range: 0.6V to 5.3V; Output Noise: 16uV (RMS) from 10Hz to 100KHz; PSRR at 5KHz: 92dB; Accuracy: +/- 1.5% (over load, line, and temperature); Output Voltage Selection: Pin selection; Max Output Voltage: 5.3V; Max Power Dissipation: 953.5mW; Min Current Limit: 600mA; Min Output Voltage: 600mV; Output Type: Adjustable; Polarity: Positive; Power Supply Rejection Ratio (PSRR): 85dB; Supplier 1: Mouser; Supplier Part Number 1: 700-MAX8902BATAT; Datasheet: https://datasheets.maximintegrated.com/en/ds/MAX8902-MAX8902B.pdf; ComponentLink1Description: Datasheet; ComponentLink1URL: https://datasheets.maximintegrated.com/en/ds/MAX8902-MAX8902B.pdf; Max Operating Temperature: 125°C; Max Output Current: 500mA; Min Operating Temperature: -40°C; Power Rating: 953.5mW

## Sheet Relays.SchDoc
size A
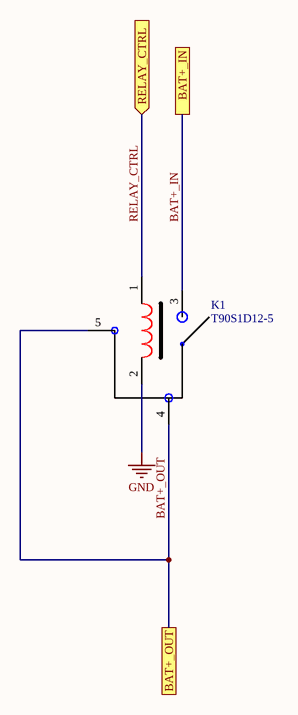
[diagram p4: Relays.SchDoc]

### Parts
K1  T90S1D12-5  [T90S]

### Ports
BAT+_IN, BAT+_OUT, RELAY_CTRL (in)

### Nets
GND: K1.2(Coil)
BAT+_IN: K1.3(Contact) ; port BAT+_IN  [project net BAT+]
BAT+_OUT: K1.4(Contact) K1.5(Contact) ; port BAT+_OUT
RELAY_CTRL: K1.1(Coil) ; port RELAY_CTRL

### Library data of the parts
K1 = T90S1D12-5: General Purpose Relays SPST-NO PCB 5 VDC; Manufacturer: TE Connectivity; Coil Power: 1W; Power Consumption: 2.8W; Coil Current: 185mA; Current Rating: 30A; Voltage Rating (DC): 5V; Release Time: 15ms; Throw Configuration: SPST; Max Voltage Rating (AC): 277V; Coil Resistance: 27R; Coil Type: Non-Latching; Voltage Rating (AC): 240V; Supplier 1: Mouser; Contact Material: Silver,Cadmium; Manufacturer Part Number: T90S1D12-5; Height: 20.4mm; Depth: 25.9mm; Length: 32.3mm; Weight: 0.918oz; Operate Time: 15ms; Coil Voltage (DC): 5V; Width: 27.4mm; Contact Voltage Rating (AC): 277V; Number of Pins: 5; Max Operating Temperature: 85°C; Min Operating Temperature: -55°C; Mount: Through Hole,PCB; Contact Current Rating: 30A; ComponentLink1URL: https://datasheet.ciiva.com/2406/eng-ds-1308242-t90-0214-t90-2406880.pdf; ComponentLink1Description: https://datasheet.ciiva.com/2406/eng-ds-1308242-t90-0214-t90-2406880.pdf; ComponentLink2URL: https://datasheet.ciiva.com/30468/0900766b8107bb2d-30468875.pdf; ComponentLink2Description: https://datasheet.ciiva.com/30468/0900766b8107bb2d-30468875.pdf; ComponentLink3URL: https://datasheet.ciiva.com/7999/1470339-7999710.pdf; ComponentLink3Description: https://datasheet.ciiva.com/7999/1470339-7999710.pdf; Supplier Part Number 1: 655-T90S1D12-5

## Sheet Signal_Multiplexers.SchDoc
size C
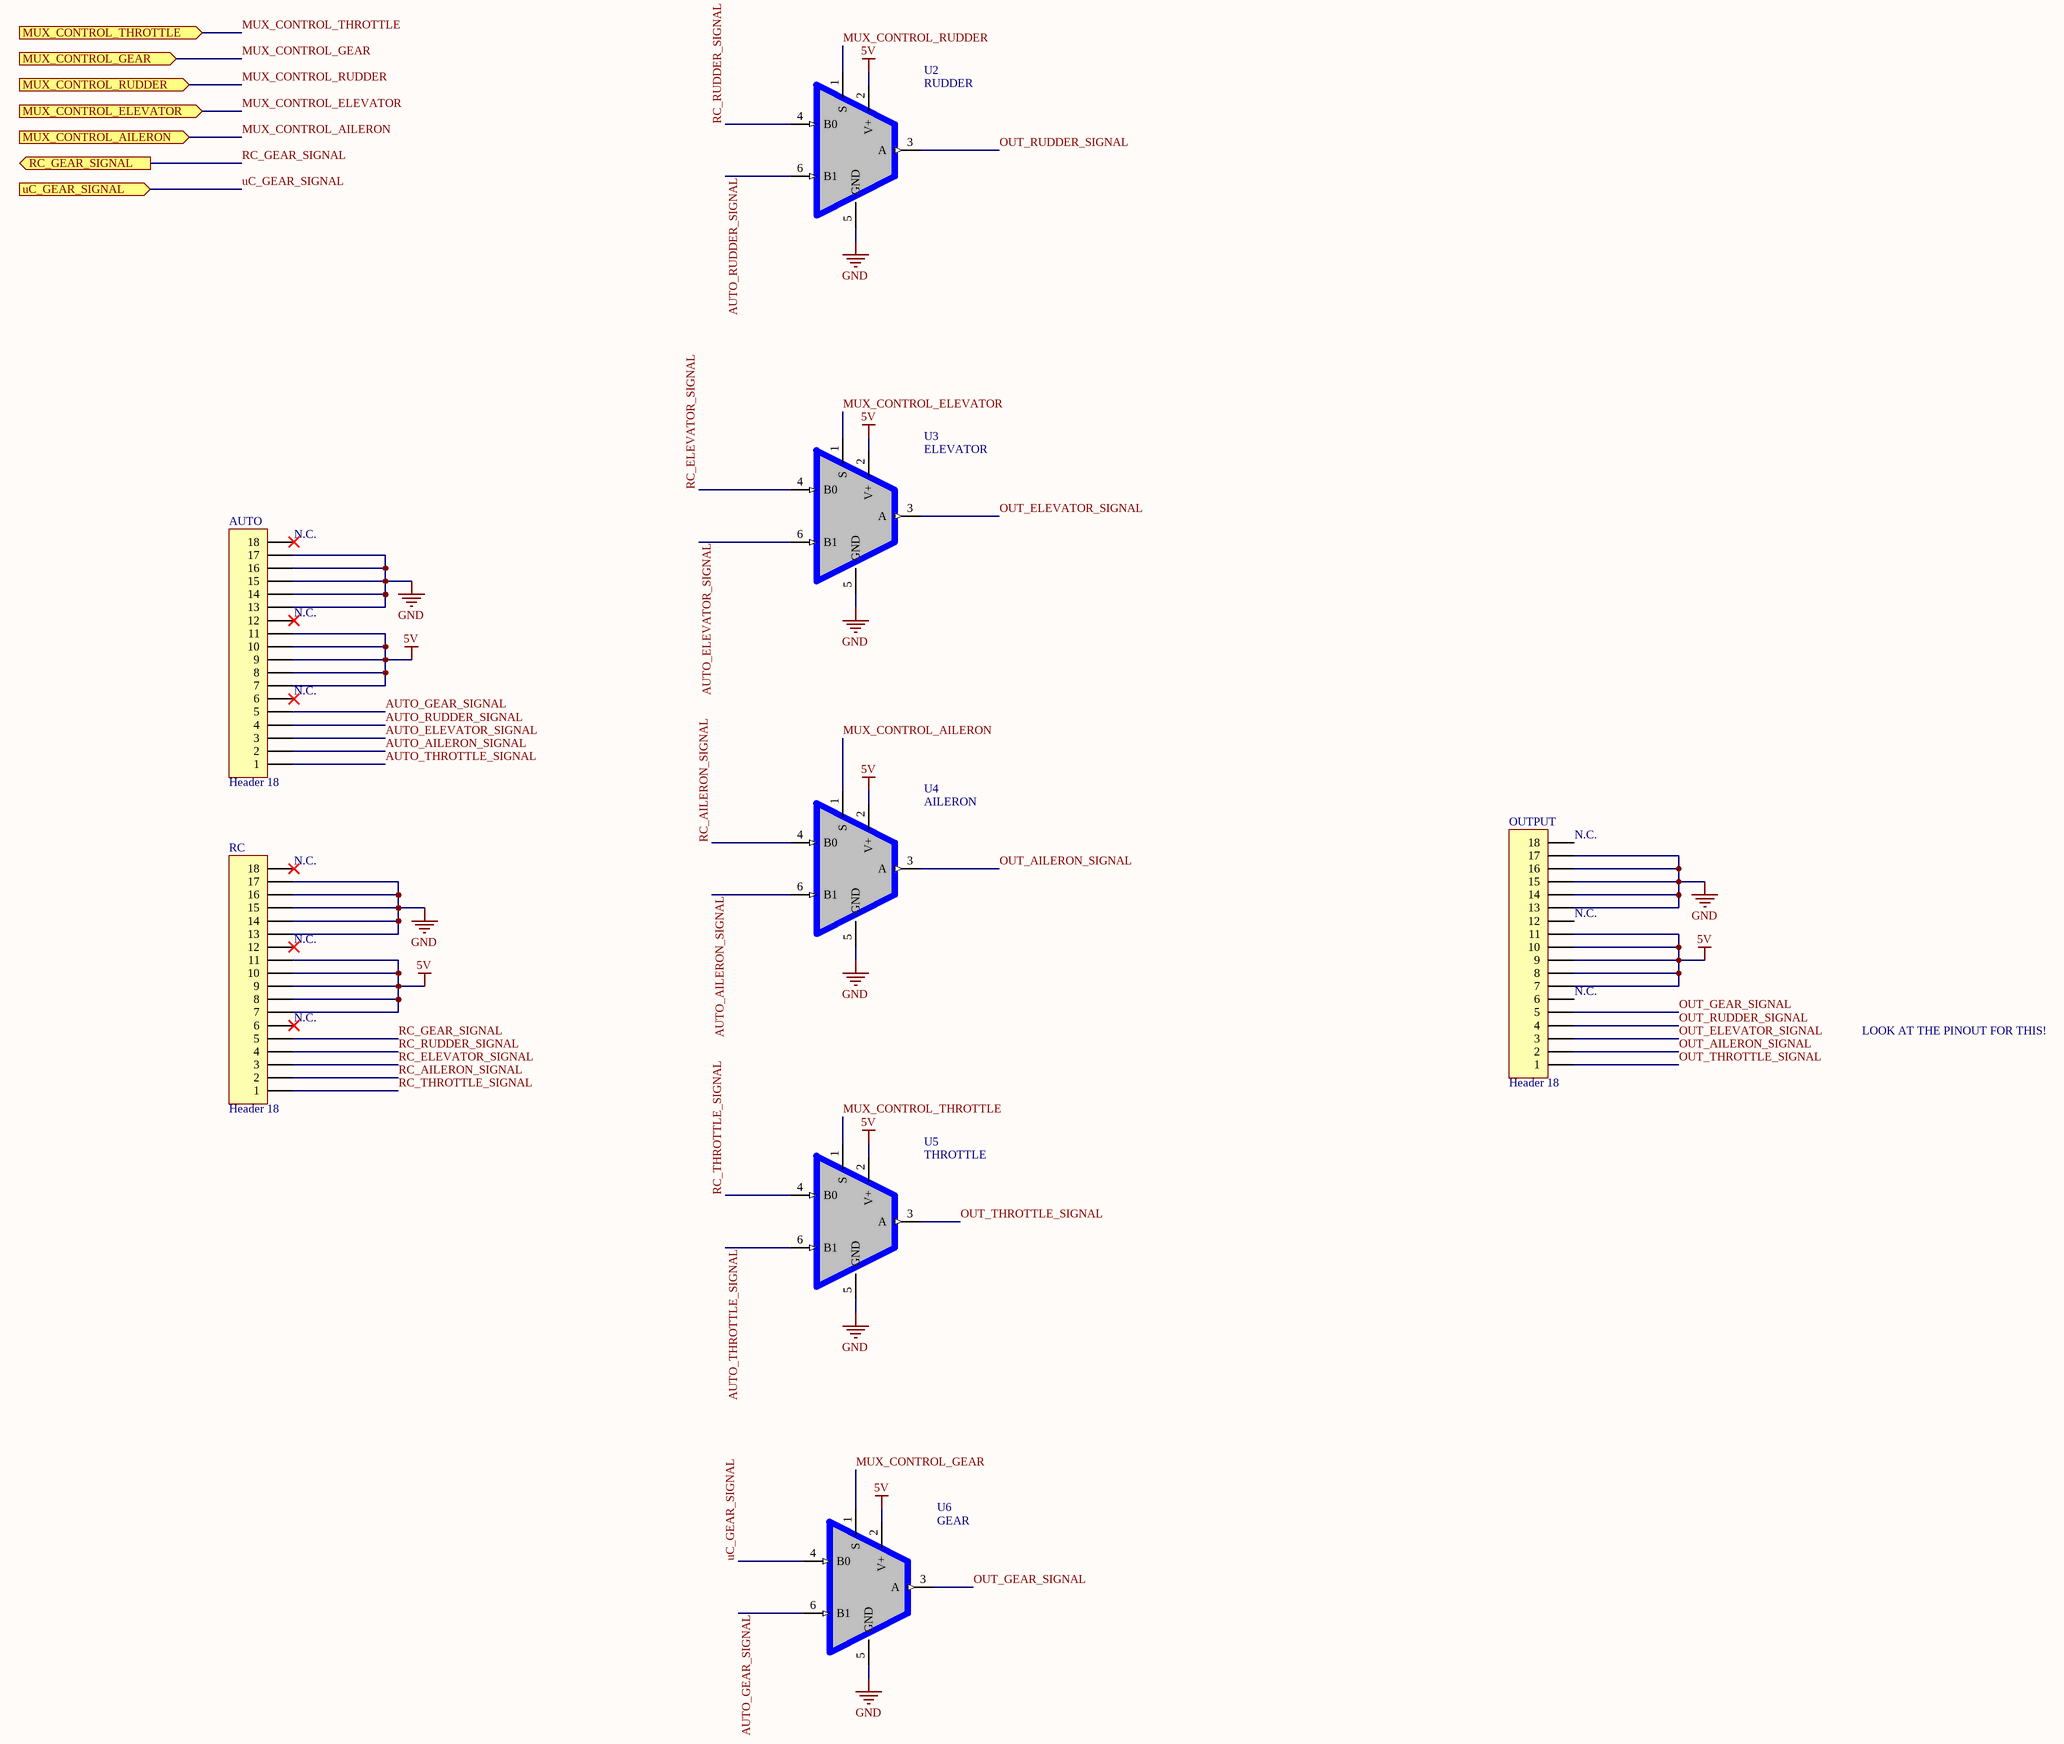
[diagram p5: Signal_Multiplexers.SchDoc]

### Parts
AUTO  Header 18  [PCBComponent_1]
OUTPUT  Header 18  [PCBComponent_1]
RC  Header 18  [PCBComponent_1]
U2  RUDDER  [uDFN-6L]
U3  ELEVATOR  [uDFN-6L]
U4  AILERON  [uDFN-6L]
U5  THROTTLE  [uDFN-6L]
U6  GEAR  [uDFN-6L]

### Ports
MUX_CONTROL_AILERON (in), MUX_CONTROL_ELEVATOR (in), MUX_CONTROL_GEAR (in), MUX_CONTROL_RUDDER (in), MUX_CONTROL_THROTTLE (in), RC_GEAR_SIGNAL (out), uC_GEAR_SIGNAL (in)

### Nets
5V: AUTO.7 AUTO.8 AUTO.9 AUTO.10 AUTO.11 OUTPUT.7 OUTPUT.8 OUTPUT.9 OUTPUT.10 OUTPUT.11 RC.7 RC.8 RC.9 RC.10 RC.11 U2.2(V+) U3.2(V+) U4.2(V+) U5.2(V+) U6.2(V+)
GND: AUTO.13 AUTO.14 AUTO.15 AUTO.16 AUTO.17 OUTPUT.13 OUTPUT.14 OUTPUT.15 OUTPUT.16 OUTPUT.17 RC.13 RC.14 RC.15 RC.16 RC.17 U2.5(GND) U3.5(GND) U4.5(GND) U5.5(GND) U6.5(GND)
AUTO_AILERON_SIGNAL: AUTO.2 U4.6(B1)
AUTO_ELEVATOR_SIGNAL: AUTO.3 U3.6(B1)
AUTO_GEAR_SIGNAL: AUTO.5 U6.6(B1)
AUTO_RUDDER_SIGNAL: AUTO.4 U2.6(B1)
AUTO_THROTTLE_SIGNAL: AUTO.1 U5.6(B1)
MUX_CONTROL_AILERON: U4.1(S) ; port MUX_CONTROL_AILERON
MUX_CONTROL_ELEVATOR: U3.1(S) ; port MUX_CONTROL_ELEVATOR
MUX_CONTROL_GEAR: U6.1(S) ; port MUX_CONTROL_GEAR
MUX_CONTROL_RUDDER: U2.1(S) ; port MUX_CONTROL_RUDDER
MUX_CONTROL_THROTTLE: U5.1(S) ; port MUX_CONTROL_THROTTLE
OUT_AILERON_SIGNAL: OUTPUT.2 U4.3(A)
OUT_ELEVATOR_SIGNAL: OUTPUT.3 U3.3(A)
OUT_GEAR_SIGNAL: OUTPUT.5 U6.3(A)
OUT_RUDDER_SIGNAL: OUTPUT.4 U2.3(A)
OUT_THROTTLE_SIGNAL: OUTPUT.1 U5.3(A)
RC_AILERON_SIGNAL: RC.2 U4.4(B0)
RC_ELEVATOR_SIGNAL: RC.3 U3.4(B0)
RC_Gear_Signal: RC.5 ; port RC_GEAR_SIGNAL
RC_RUDDER_SIGNAL: RC.4 U2.4(B0)
RC_THROTTLE_SIGNAL: RC.1 U5.4(B0)
uC_Gear_Signal: U6.4(B0) ; port uC_GEAR_SIGNAL

Not connected (* = marked no-connect by the designer): AUTO 6* 12* 18*; OUTPUT 6 12 18; RC 6* 12* 18*

### Notes on the sheet
- (near AUTO) N.C.
- (near RC) N.C.
- (near OUTPUT) N.C.
- LOOK AT THE PINOUT FOR THIS!
- Title
- Size:
- Date:
- File:
- C
- Number:
- Time:
- Revision:
- Sheet
- of

### Library data of the parts
AUTO OUTPUT RC = Header 18: Header, 18-Pin; Manufacturer: Preci-Dip; Manufacturer Part Number: 894-80-030-20-001101; Pitch: 0.1inch; LatestRevisionDate: 17-Jul-2002; LatestRevisionNote: Re-released for DXP Platform.; Publisher: Altium Limited; Supplier 1: Mouser; Supplier Part Number 1: 437-8948003020001101; Contact Plating: Tin; Number of Rows: 3; Mount: Through Hole; Row Spacing: 0.1inch; ComponentLink1URL: https://datasheet.ciiva.com/18657/catalog-18657350.pdf; ComponentLink1Description: https://datasheet.ciiva.com/18657/catalog-18657350.pdf
U2-U6 = DG4157EDN: Multiplexer Switch ICs SPDT 2:1 Mutiplxr 1.65-5.5V; 0.7ohm; Supplier 2: Digi-Key; ComponentLink1Description: Datasheet; ComponentLink1URL: https://www.mouser.com/datasheet/2/427/dg4157e-1291751.pdf; ComponentLink2Description: Foorptint; ComponentLink2URL: http://www.vishay.com/docs/76086/udfn-6l.pdf; Supplier 1: Mouser; Supplier Part Number 2: DG4157EDN-T1-GE4TR-ND; Supplier Part Number 1: 78-DG4157EDN-T1-GE4

## Nets that join several sheets
5V: Microcontroller (11 pins), Power_Supplies (5 pins), Signal_Multiplexers (20 pins)
GND: Microcontroller (20 pins), Power (P1.2 P2.2), Power_Supplies (15 pins), Relays (K1.2), Signal_Multiplexers (20 pins)
BAT+: Power (P1.1), Power_Supplies (C1.1 R6.2 U7.7), Relays (K1.3)
BAT+_OUT: Power (P2.1), Relays (K1.4 K1.5)
MUX_CONTROL_AILERON: Microcontroller (U1.26), Signal_Multiplexers (U4.1)
MUX_CONTROL_ELEVATOR: Microcontroller (U1.25), Signal_Multiplexers (U3.1)
MUX_CONTROL_GEAR: Microcontroller (U1.23), Signal_Multiplexers (U6.1)
MUX_CONTROL_RUDDER: Microcontroller (U1.24), Signal_Multiplexers (U2.1)
MUX_CONTROL_THROTTLE: Microcontroller (U1.27), Signal_Multiplexers (U5.1)
RC_Gear_Signal: Microcontroller (U1.12), Signal_Multiplexers (RC.5)
RELAY_CTRL: Microcontroller (U1.28), Relays (K1.1)
uC_Gear_Signal: Microcontroller (U1.13), Signal_Multiplexers (U6.4)